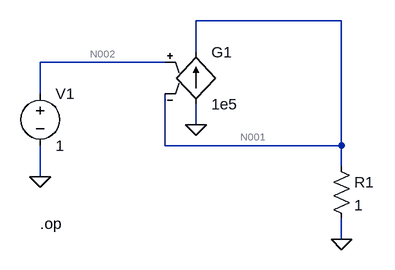
[diagram p0: schematic g_feedback.asc]
g_feedback.asc, the LTspice schematic file:
Version 4
SHEET 1 880 680
WIRE 416 80 192 80
WIRE 192 128 192 80
WIRE 144 144 -48 144
WIRE -48 192 -48 144
WIRE 192 240 192 208
WIRE 144 272 144 192
WIRE 416 272 416 80
WIRE 416 272 144 272
WIRE 416 304 416 272
WIRE -48 320 -48 272
WIRE 416 416 416 384
FLAG 416 416 0
FLAG 192 240 0
FLAG -48 320 0
SYMBOL g 192 112 R0
SYMATTR InstName G1
SYMATTR Value 1e5
SYMBOL res 400 288 R0
SYMATTR InstName R1
SYMATTR Value 1
SYMBOL voltage -48 176 R0
WINDOW 123 0 0 Left 0
WINDOW 39 0 0 Left 0
SYMATTR InstName V1
SYMATTR Value 1
TEXT -48 392 Left 0 !.op

The netlist it stands for:
* g_feedback.asc
G1 0 N001 N002 N001 1e5
R1 N001 0 1
V1 N002 0 1
.op
.backanno
.end

* Results of the author's LTspice run, read from the files saved beside the schematic
* Operating Point:
*   V(n001) = 1 V
*   V(n002) = 1 V
*   I(R1) = 1 A
*   I(G1) = 1 A
*   I(V1) = 0 A